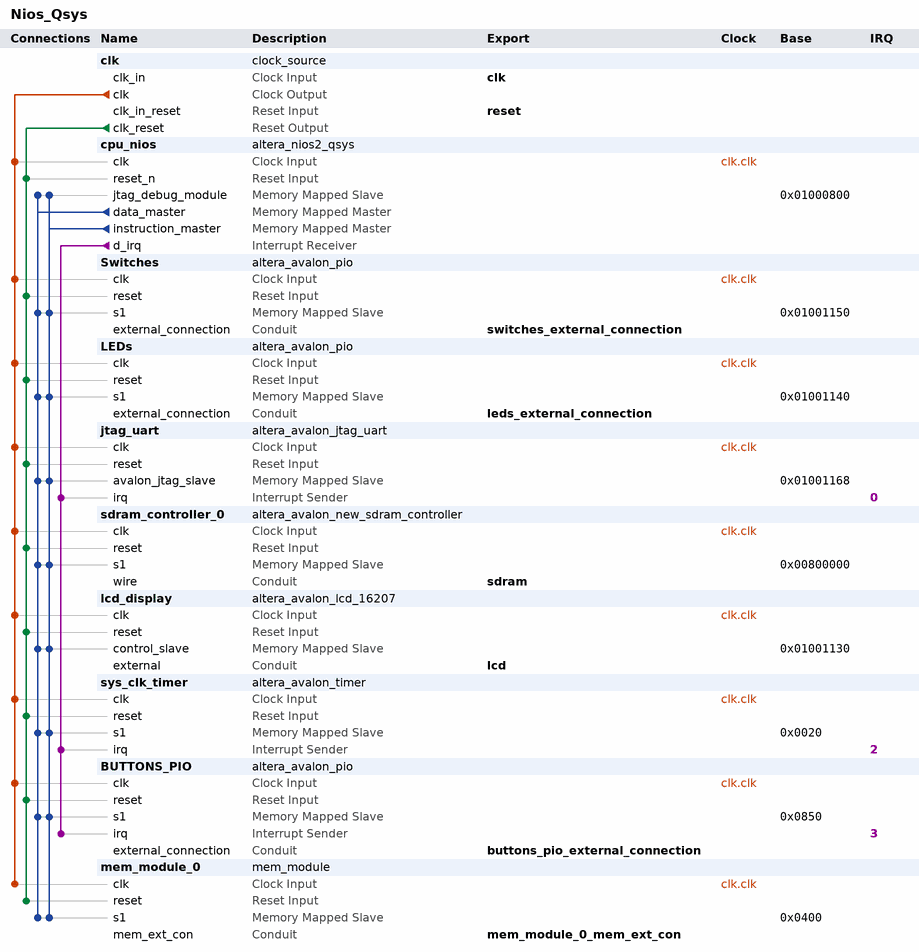
[diagram p0: system contents]
# Platform Designer (Qsys) system Nios_Qsys, Cyclone II EP2C35F672C6
# Parameters at their usual value, and those the tool derives, are not listed.
package require -exact qsys 13.0.1.99.2
create_system Nios_Qsys
set_project_property DEVICE_FAMILY {Cyclone II}
set_project_property DEVICE EP2C35F672C6

add_instance clk clock_source 13.0
set_instance_parameter_value clk clockFrequency 50000000

add_instance cpu_nios altera_nios2_qsys 13.0
set_instance_parameter_value cpu_nios resetSlave sdram_controller_0.s1
set_instance_parameter_value cpu_nios mmu_TLBMissExcSlave None
set_instance_parameter_value cpu_nios exceptionSlave sdram_controller_0.s1
set_instance_parameter_value cpu_nios breakSlave cpu_nios.jtag_debug_module
set_instance_parameter_value cpu_nios impl Tiny
set_instance_parameter_value cpu_nios icache_size 4096

add_instance Switches altera_avalon_pio 13.0.1.99.2
set_instance_parameter_value Switches direction Input
set_instance_parameter_value Switches width 18

add_instance LEDs altera_avalon_pio 13.0.1.99.2
set_instance_parameter_value LEDs direction Output
set_instance_parameter_value LEDs width 18

add_instance jtag_uart altera_avalon_jtag_uart 13.0.1.99.2
set_instance_parameter_value jtag_uart simInteractiveOptions NO_INTERACTIVE_WINDOWS

add_instance sdram_controller_0 altera_avalon_new_sdram_controller 13.0.1.99.2
set_instance_parameter_value sdram_controller_0 TAC 5.5
set_instance_parameter_value sdram_controller_0 TRCD 20.0
set_instance_parameter_value sdram_controller_0 TRP 20.0
set_instance_parameter_value sdram_controller_0 casLatency 3
set_instance_parameter_value sdram_controller_0 columnWidth 8
set_instance_parameter_value sdram_controller_0 dataWidth 16
set_instance_parameter_value sdram_controller_0 generateSimulationModel false
set_instance_parameter_value sdram_controller_0 model single_Micron_MT48LC4M32B2_7_chip
set_instance_parameter_value sdram_controller_0 numberOfBanks 4
set_instance_parameter_value sdram_controller_0 numberOfChipSelects 1
set_instance_parameter_value sdram_controller_0 powerUpDelay 100.0
set_instance_parameter_value sdram_controller_0 refreshPeriod 15.625
set_instance_parameter_value sdram_controller_0 rowWidth 12

add_instance lcd_display altera_avalon_lcd_16207 13.0.1.99.2

add_instance sys_clk_timer altera_avalon_timer 13.0.1.99.2
set_instance_parameter_value sys_clk_timer period 10
set_instance_parameter_value sys_clk_timer periodUnits MSEC

add_instance BUTTONS_PIO altera_avalon_pio 13.0.1.99.2
set_instance_parameter_value BUTTONS_PIO captureEdge true
set_instance_parameter_value BUTTONS_PIO direction Input
set_instance_parameter_value BUTTONS_PIO edgeType ANY
set_instance_parameter_value BUTTONS_PIO generateIRQ true
set_instance_parameter_value BUTTONS_PIO irqType EDGE
set_instance_parameter_value BUTTONS_PIO width 3

add_instance mem_module_0 mem_module 1.0

# connections
add_connection clk.clk BUTTONS_PIO.clk clock
add_connection clk.clk cpu_nios.clk clock
add_connection clk.clk jtag_uart.clk clock
add_connection clk.clk lcd_display.clk clock
add_connection clk.clk LEDs.clk clock
add_connection clk.clk mem_module_0.clk clock
add_connection clk.clk sdram_controller_0.clk clock
add_connection clk.clk Switches.clk clock
add_connection clk.clk sys_clk_timer.clk clock
add_connection clk.clk_reset BUTTONS_PIO.reset reset
add_connection clk.clk_reset cpu_nios.reset_n reset
add_connection clk.clk_reset jtag_uart.reset reset
add_connection clk.clk_reset lcd_display.reset reset
add_connection clk.clk_reset LEDs.reset reset
add_connection clk.clk_reset mem_module_0.reset reset
add_connection clk.clk_reset sdram_controller_0.reset reset
add_connection clk.clk_reset Switches.reset reset
add_connection clk.clk_reset sys_clk_timer.reset reset
add_connection cpu_nios.data_master BUTTONS_PIO.s1 avalon
set_connection_parameter_value cpu_nios.data_master/BUTTONS_PIO.s1 baseAddress 0x0850
add_connection cpu_nios.data_master cpu_nios.jtag_debug_module avalon
set_connection_parameter_value cpu_nios.data_master/cpu_nios.jtag_debug_module baseAddress 0x01000800
add_connection cpu_nios.data_master jtag_uart.avalon_jtag_slave avalon
set_connection_parameter_value cpu_nios.data_master/jtag_uart.avalon_jtag_slave baseAddress 0x01001168
add_connection cpu_nios.data_master lcd_display.control_slave avalon
set_connection_parameter_value cpu_nios.data_master/lcd_display.control_slave baseAddress 0x01001130
add_connection cpu_nios.data_master LEDs.s1 avalon
set_connection_parameter_value cpu_nios.data_master/LEDs.s1 baseAddress 0x01001140
add_connection cpu_nios.data_master mem_module_0.s1 avalon
set_connection_parameter_value cpu_nios.data_master/mem_module_0.s1 baseAddress 0x0400
add_connection cpu_nios.data_master sdram_controller_0.s1 avalon
set_connection_parameter_value cpu_nios.data_master/sdram_controller_0.s1 baseAddress 0x00800000
add_connection cpu_nios.data_master Switches.s1 avalon
set_connection_parameter_value cpu_nios.data_master/Switches.s1 baseAddress 0x01001150
add_connection cpu_nios.data_master sys_clk_timer.s1 avalon
set_connection_parameter_value cpu_nios.data_master/sys_clk_timer.s1 baseAddress 0x0020
add_connection cpu_nios.instruction_master BUTTONS_PIO.s1 avalon
set_connection_parameter_value cpu_nios.instruction_master/BUTTONS_PIO.s1 baseAddress 0x0850
add_connection cpu_nios.instruction_master cpu_nios.jtag_debug_module avalon
set_connection_parameter_value cpu_nios.instruction_master/cpu_nios.jtag_debug_module baseAddress 0x01000800
add_connection cpu_nios.instruction_master jtag_uart.avalon_jtag_slave avalon
set_connection_parameter_value cpu_nios.instruction_master/jtag_uart.avalon_jtag_slave baseAddress 0x01001168
add_connection cpu_nios.instruction_master lcd_display.control_slave avalon
set_connection_parameter_value cpu_nios.instruction_master/lcd_display.control_slave baseAddress 0x01001130
add_connection cpu_nios.instruction_master LEDs.s1 avalon
set_connection_parameter_value cpu_nios.instruction_master/LEDs.s1 baseAddress 0x01001140
add_connection cpu_nios.instruction_master mem_module_0.s1 avalon
set_connection_parameter_value cpu_nios.instruction_master/mem_module_0.s1 baseAddress 0x0400
add_connection cpu_nios.instruction_master sdram_controller_0.s1 avalon
set_connection_parameter_value cpu_nios.instruction_master/sdram_controller_0.s1 baseAddress 0x00800000
add_connection cpu_nios.instruction_master Switches.s1 avalon
set_connection_parameter_value cpu_nios.instruction_master/Switches.s1 baseAddress 0x01001150
add_connection cpu_nios.instruction_master sys_clk_timer.s1 avalon
set_connection_parameter_value cpu_nios.instruction_master/sys_clk_timer.s1 baseAddress 0x0020
add_connection cpu_nios.d_irq BUTTONS_PIO.irq interrupt
set_connection_parameter_value cpu_nios.d_irq/BUTTONS_PIO.irq irqNumber 3
add_connection cpu_nios.d_irq jtag_uart.irq interrupt
set_connection_parameter_value cpu_nios.d_irq/jtag_uart.irq irqNumber 0
add_connection cpu_nios.d_irq sys_clk_timer.irq interrupt
set_connection_parameter_value cpu_nios.d_irq/sys_clk_timer.irq irqNumber 2

# exported interfaces
add_interface clk clock sink
set_interface_property clk EXPORT_OF clk.clk_in
add_interface switches_external_connection conduit end
set_interface_property switches_external_connection EXPORT_OF Switches.external_connection
add_interface leds_external_connection conduit end
set_interface_property leds_external_connection EXPORT_OF LEDs.external_connection
add_interface reset reset sink
set_interface_property reset EXPORT_OF clk.clk_in_reset
add_interface sdram conduit end
set_interface_property sdram EXPORT_OF sdram_controller_0.wire
add_interface lcd conduit end
set_interface_property lcd EXPORT_OF lcd_display.external
add_interface buttons_pio_external_connection conduit end
set_interface_property buttons_pio_external_connection EXPORT_OF BUTTONS_PIO.external_connection
add_interface mem_module_0_mem_ext_con conduit end
set_interface_property mem_module_0_mem_ext_con EXPORT_OF mem_module_0.mem_ext_con

set_interconnect_requirement {$system} qsys_mm.clockCrossingAdapter HANDSHAKE
set_interconnect_requirement {$system} qsys_mm.maxAdditionalLatency 0

save_system Nios_Qsys.qsys
